# EAGLE design slave_05 (EAGLE 5.08)
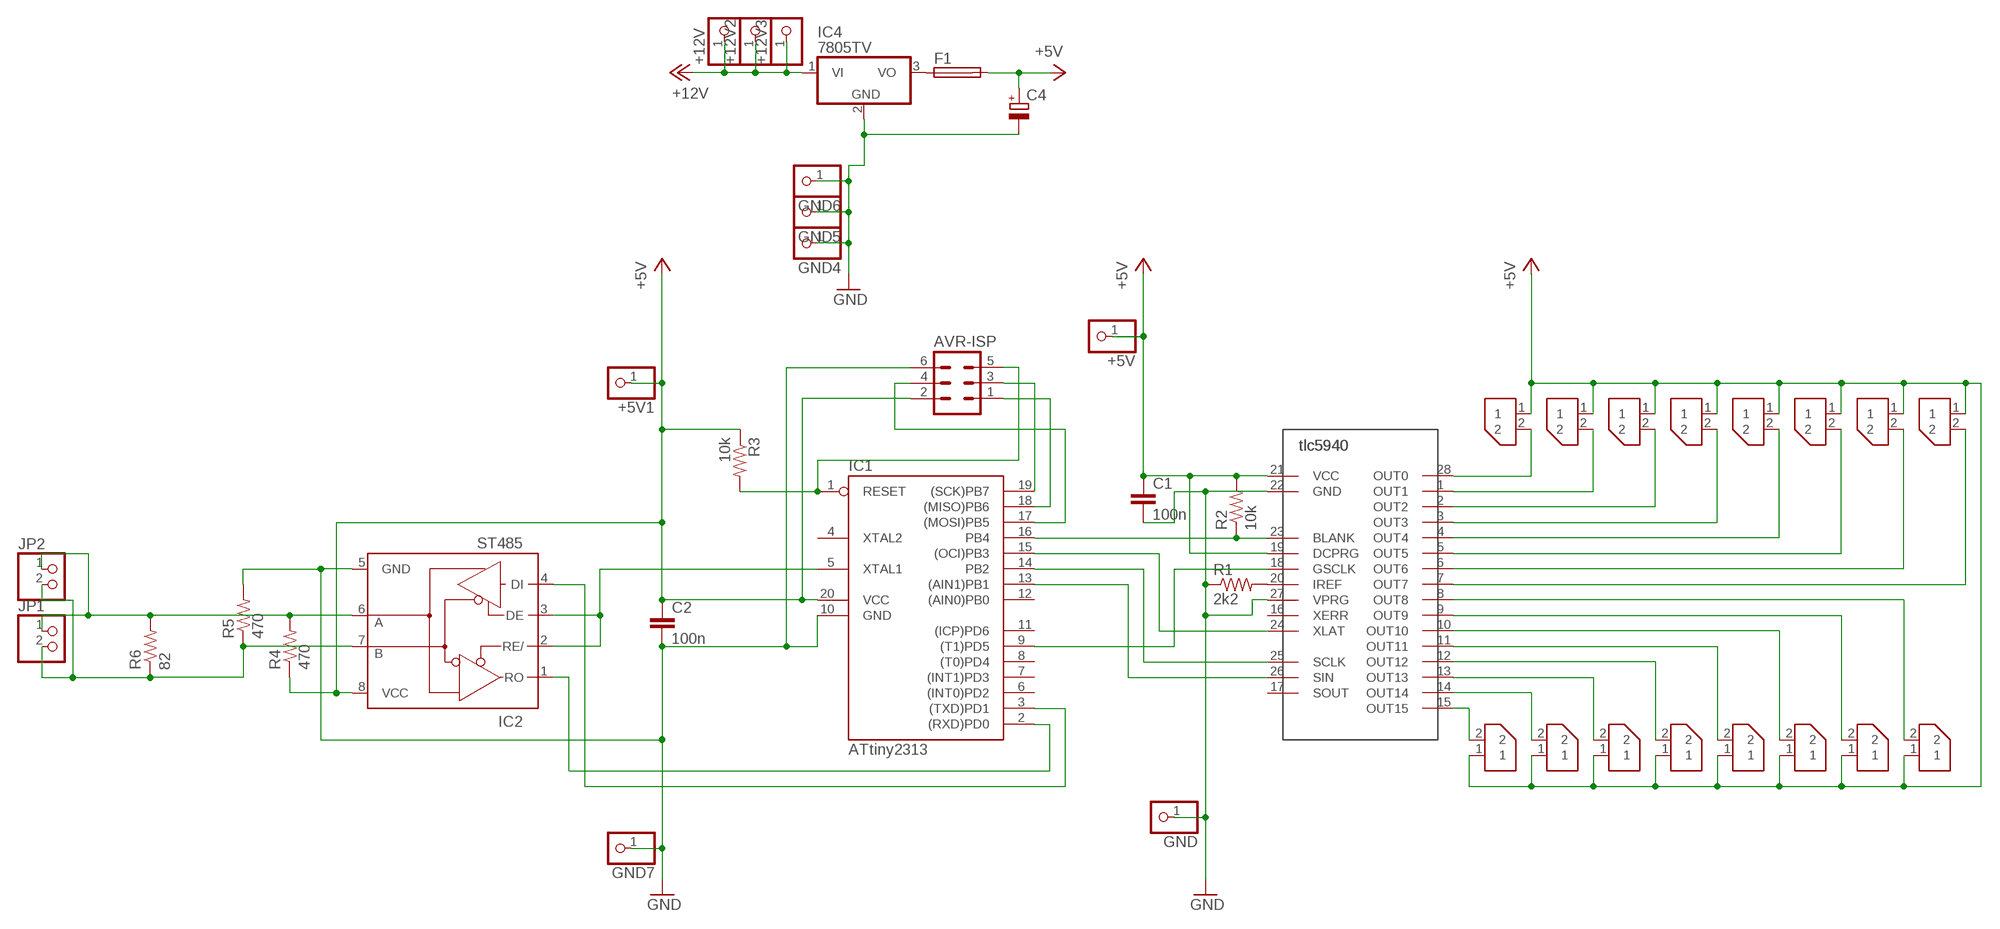
[diagram p0: schematic, sheet 1]

## Parts
+5V  PINHD-1X1  [1X01]
+5V1  PINHD-1X1  [1X01]
+12V  PINHD-1X1  [1X01]
+12V2  PINHD-1X1  [1X01]
+12V3  PINHD-1X1  [1X01]
AVR-ISP  ML6  [ML6]
C1  100n  C7.5/3  [C7.5B3]
C2  100n  C7.5/3  [C7.5B3]
C4  CPOL-EUE5-5  [E5-5]
F1  SH22,5A  [SH22,5A]
GND  PINHD-1X1  [1X01]
GND4  PINHD-1X1  [1X01]
GND5  PINHD-1X1  [1X01]
GND6  PINHD-1X1  [1X01]
GND7  PINHD-1X1  [1X01]
IC1  ATtiny2313  AT90S2313P  [DIL20]
IC2  ST485  MAX3468CPA  [DIL08]
IC4  7805TV  [TO220V]
JP1  PINHD-1X2  [1X02]
JP2  PINHD-1X2  [1X02]
R1  2k2  R-US_0204/7  [0204/7]
R2  10k  R-US_0207/10  [0207/10]
R3  10k  R-US_0204/7  [0204/7]
R4  470  R-US_0204/7  [0204/7]
R5  470  R-US_0204/7  [0204/7]
R6  82  R-US_0204/7  [0204/7]
U$1  TLC5940-NT  [28-DIL-300]
U$2  MOLEX-SPOX-HEADER-2-RA  [SPOX-WTB-HEADER-2-RA]
U$3  MOLEX-SPOX-HEADER-2-RA  [SPOX-WTB-HEADER-2-RA]
U$4  MOLEX-SPOX-HEADER-2-RA  [SPOX-WTB-HEADER-2-RA]
U$5  MOLEX-SPOX-HEADER-2-RA  [SPOX-WTB-HEADER-2-RA]
U$6  MOLEX-SPOX-HEADER-2-RA  [SPOX-WTB-HEADER-2-RA]
U$7  MOLEX-SPOX-HEADER-2-RA  [SPOX-WTB-HEADER-2-RA]
U$8  MOLEX-SPOX-HEADER-2-RA  [SPOX-WTB-HEADER-2-RA]
U$9  MOLEX-SPOX-HEADER-2-RA  [SPOX-WTB-HEADER-2-RA]
U$10  MOLEX-SPOX-HEADER-2-RA  [SPOX-WTB-HEADER-2-RA]
U$11  MOLEX-SPOX-HEADER-2-RA  [SPOX-WTB-HEADER-2-RA]
U$12  MOLEX-SPOX-HEADER-2-RA  [SPOX-WTB-HEADER-2-RA]
U$13  MOLEX-SPOX-HEADER-2-RA  [SPOX-WTB-HEADER-2-RA]
U$14  MOLEX-SPOX-HEADER-2-RA  [SPOX-WTB-HEADER-2-RA]
U$15  MOLEX-SPOX-HEADER-2-RA  [SPOX-WTB-HEADER-2-RA]
U$16  MOLEX-SPOX-HEADER-2-RA  [SPOX-WTB-HEADER-2-RA]
U$17  MOLEX-SPOX-HEADER-2-RA  [SPOX-WTB-HEADER-2-RA]

## Nets
+5V: +5V1.1 +5V.1 AVR-ISP.2 C1.1 C2.1 C4.+ F1.2 IC1.20(VCC) IC2.8(VCC) R2.2 R3.1 R4.1 U$1.19(DCPRG) U$1.21(VCC) U$2.1 U$3.1 U$4.1 U$5.1 U$6.1 U$7.1 U$8.1 U$9.1 U$10.1 U$11.1 U$12.1 U$13.1 U$14.1 U$15.1 U$16.1 U$17.1
+12V1: +12V2.1 +12V3.1 +12V.1 IC4.1(VI) ; supply symbol labelled +12V
GND: AVR-ISP.6 C1.2 C2.2 C4.- GND4.1 GND5.1 GND6.1 GND7.1 GND.1 IC1.10(GND) IC2.5(GND) IC4.2(GND) R1.1 R5.2 U$1.22(GND) U$1.27(VPRG)
N$1: IC1.15((OCI)PB3) U$1.24(XLAT)
N$2: IC1.16(PB4) R2.1 U$1.23(BLANK)
N$3: IC1.9((T1)PD5) U$1.18(GSCLK)
N$4: IC1.14(PB2) U$1.25(SCLK)
N$5: IC1.13((AIN1)PB1) U$1.26(SIN)
N$6: R1.2 U$1.20(IREF)
N$7: IC1.3((TXD)PD1) IC2.4(DI)
N$8: AVR-ISP.1 IC1.18((MISO)PB6)
N$10: IC1.2((RXD)PD0) IC2.1(RO)
N$11: AVR-ISP.3 IC1.19((SCK)PB7)
N$12: F1.1 IC4.3(VO)
N$13: U$1.28(OUT0) U$2.2
N$14: AVR-ISP.4 IC1.17((MOSI)PB5)
N$15: U$1.1(OUT1) U$3.2
N$16: U$1.2(OUT2) U$4.2
N$17: U$1.3(OUT3) U$5.2
N$18: U$1.15(OUT15) U$10.2
N$19: U$1.14(OUT14) U$11.2
N$20: U$1.13(OUT13) U$12.2
N$21: U$1.12(OUT12) U$13.2
N$22: U$1.11(OUT11) U$14.2
N$23: U$1.10(OUT10) U$15.2
N$24: U$1.9(OUT9) U$16.2
N$25: U$1.8(OUT8) U$17.2
N$26: U$1.4(OUT4) U$6.2
N$27: U$1.5(OUT5) U$7.2
N$28: U$1.6(OUT6) U$8.2
N$29: U$1.7(OUT7) U$9.2
N$31: AVR-ISP.5 IC1.1(RESET) R3.2
N$32: IC2.7(B) JP1.2 JP2.2 R5.1 R6.1
N$35: IC2.6(A) JP1.1 JP2.1 R4.2 R6.2
N$36: IC1.5(XTAL1) IC2.2(RE/) IC2.3(DE)
Unconnected: IC1.4(XTAL2) IC1.6((INT0)PD2) IC1.7((INT1)PD3) IC1.8((T0)PD4) IC1.11((ICP)PD6) IC1.12((AIN0)PB0) U$1.16(XERR) U$1.17(SOUT)

## Library data of the parts
+5V +5V1 +12V +12V2 +12V3 GND GND4-GND7 = pinhead:PINHD-1X1: PIN HEADER
AVR-ISP = con-harting-ml:ML6: HARTING
C1 C2 = capacitor-wima:C: CAPACITOR naming: grid - package width
C4 = resistor:CPOL-EU: POLARIZED CAPACITOR, European symbol
F1 = fuse:SH22,5A: FUSE HOLDER grid 22,5mm, isolated cap OGN0031 8201, Schurter (Buerklin)
IC1 = atmel:AT90S2313: MICROCONTROLLER 2 Kbytes FLASH 128 bytes SRAM 128 bytes EEPROM UART
IC2 = maxim:MAX34*: +5V, Fail-Safe, 40Mbps, Profibus RS-485/RS-422 Transceivers Source: MAX3465-MAX3469.pdf
IC4 = linear:78*: Positive VOLTAGE REGULATOR Source: http://cache.national.com/ds/LM/LM78L05.pdf http://www.fairchildsemi.com/ds/LM/LM7805.pdf
JP1 JP2 = pinhead:PINHD-1X2: PIN HEADER
R1-R6 = resistor:R-US_: RESISTOR, American symbol
U$1 = TLC5490:TLC5940-NT
U$2-U$17 = damians_bits:MOLEX-SPOX-HEADER-2-RA: Molex SPOX 22-05-7025 WTB Header, Right-angle, 2 way

## Board
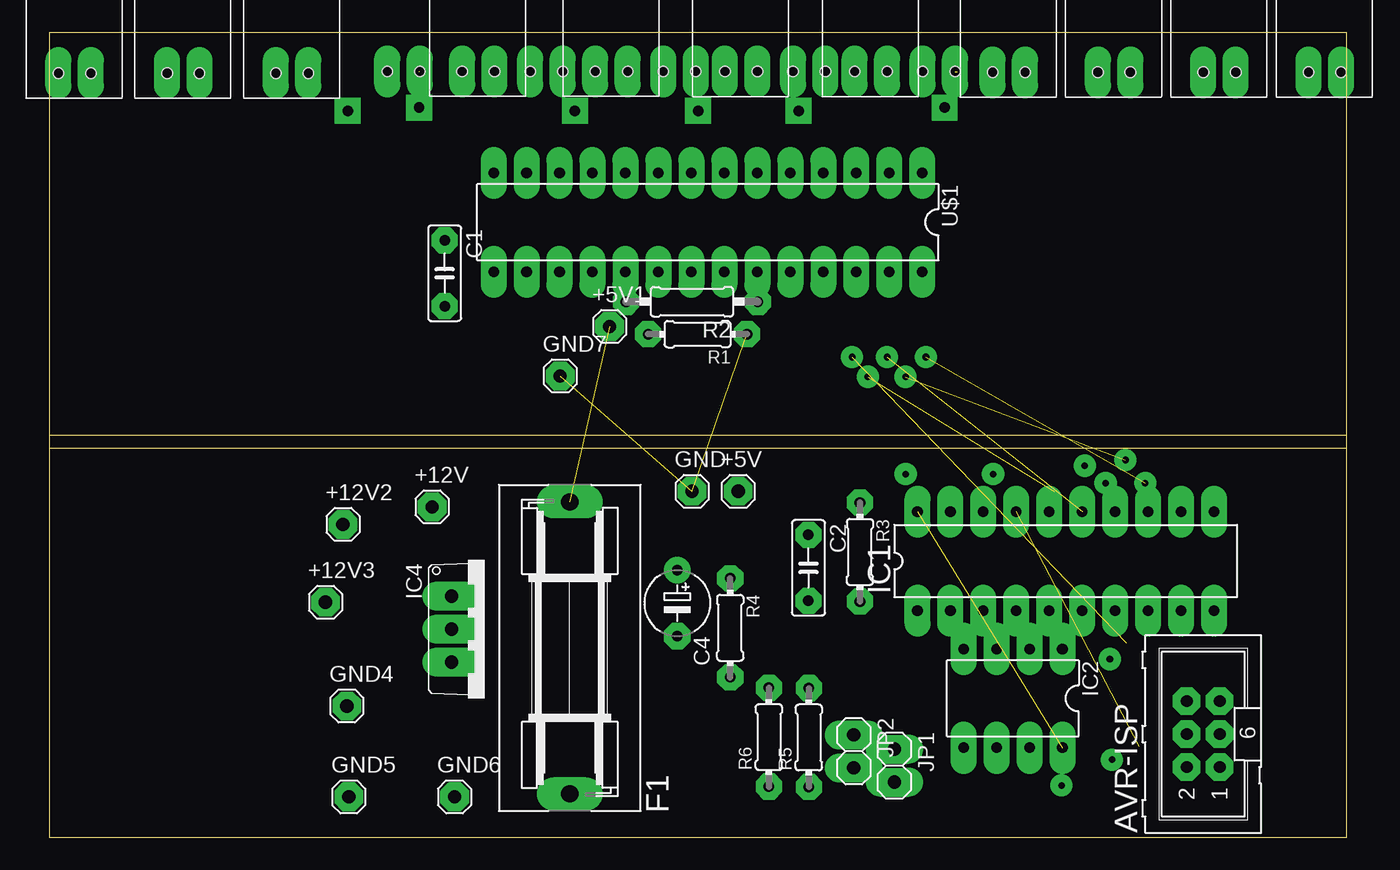
[diagram p1: board, top side]
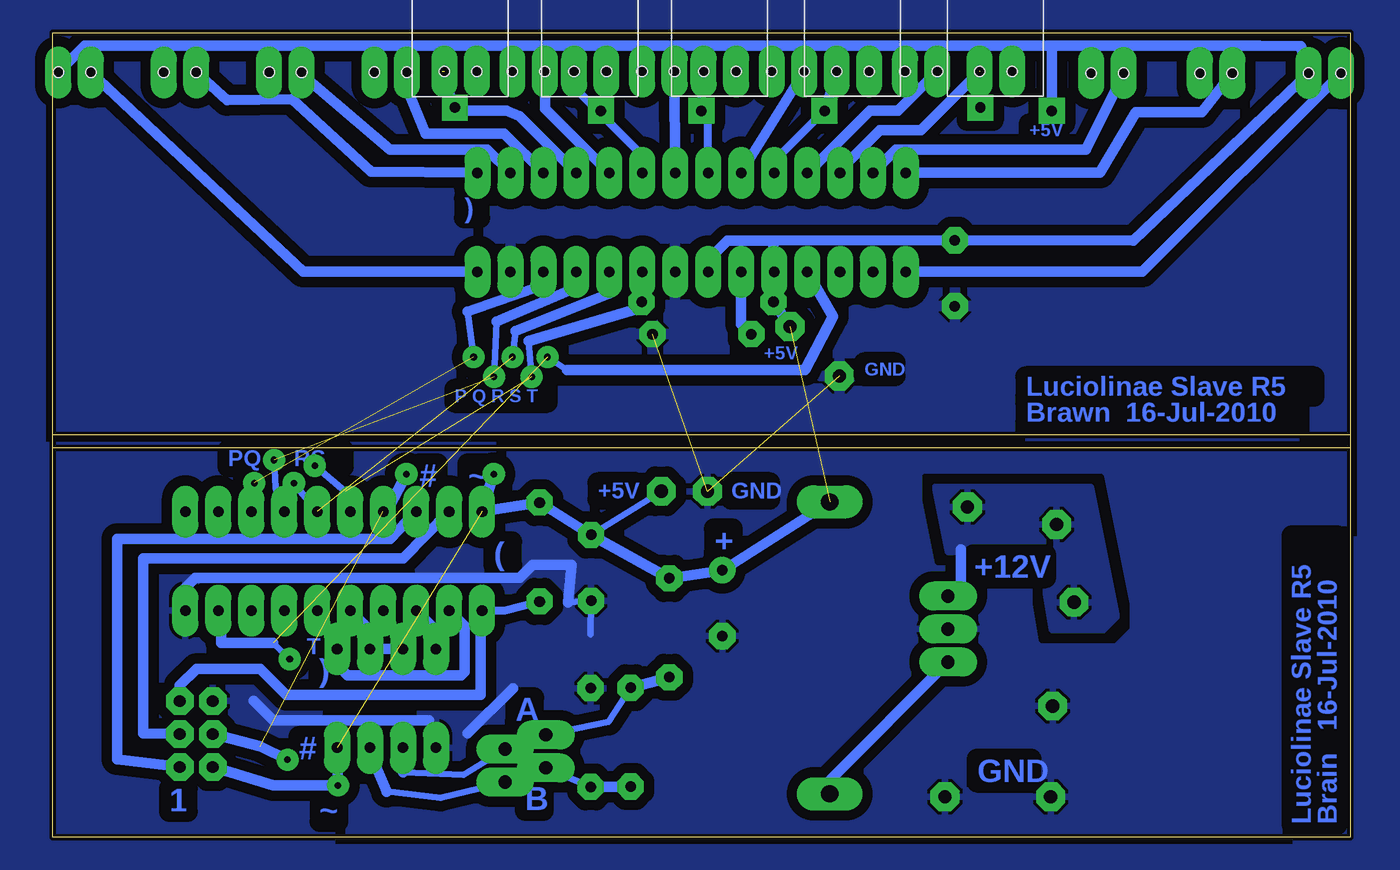
[diagram p2: board, bottom side, seen from below]

Size 100 x 62 mm. Coordinates in mm from the lower left corner, seen from the top.
Outline: 100,30 100,0 0,0 0,30
Outline: 100,30 100,31
Outline: 100,31 100,62 0,62 0,31
Outline: 0,31 0,30
Outline: 0,30 100,30
Outline: 0,31 100,31
Copper layers (1*16): Top 0.035mm / dielectric 1.5mm / Bottom 0.035mm
Design rules "default *": minimum track width 0.5mm, minimum drill 0.8mm, track to track 0.8mm, track to pad 0.8mm, pad to pad 0.45mm, via to via 0.8mm, smd to smd 8mil, copper to edge 10mil, drill to drill 8mil, minimum pad ring 0.6mm, minimum via ring 0.6mm, stop-mask expansion 0mil, vias tented up to drill 0mil, thermal gap 10mil

### Footprints (pad centres in the part's own frame; a part is rotated, then mirrored left to right if it is on the bottom)
1X01 = drill 1.016 octagon: 1 0,0
ML6 = drill 0.914 octagon: 1 -2.54,-1.27; 2 -2.54,1.27; 3 0,-1.27; 4 0,1.27; 5 2.54,-1.27; 6 2.54,1.27
C050-025X075 = drill 0.813 octagon: 1 -2.54,0; 2 2.54,0
E5-5 = drill 0.813 pad 1.905 round: + -2.54,0 | drill 0.813 pad 1.905 octagon: - 2.54,0
SH22,5A = drill 1.321 pad 2.54 long: 1 -11.252,0; 2 11.252,0
DIL20 = drill 0.813 long: 1 -11.43,-3.81; 2 -8.89,-3.81; 3 -6.35,-3.81; 4 -3.81,-3.81; 5 -1.27,-3.81; 6 1.27,-3.81; 7 3.81,-3.81; 8 6.35,-3.81; 9 8.89,-3.81; 10 11.43,-3.81; 11 11.43,3.81; 12 8.89,3.81; 13 6.35,3.81; 14 3.81,3.81; 15 1.27,3.81; 16 -1.27,3.81; 17 -3.81,3.81; 18 -6.35,3.81; 19 -8.89,3.81; 20 -11.43,3.81
DIL08 = drill 0.813 long: 1 -3.81,-3.81; 2 -1.27,-3.81; 3 1.27,-3.81; 4 3.81,-3.81; 5 3.81,3.81; 6 1.27,3.81; 7 -1.27,3.81; 8 -3.81,3.81
TO220V = drill 1.016 long: 1 -2.54,-2.54; 2 0,-2.54; 3 2.54,-2.54
1X02 = drill 1.016 long: 1 -1.27,0; 2 1.27,0
0204/7 = drill 0.813 octagon: 1 -3.81,0; 2 3.81,0
0207/10 = drill 0.813 octagon: 1 -5.08,0; 2 5.08,0
28-DIL-300 = drill 0.813 long: 1 -15.24,-3.81; 2 -12.7,-3.81; 3 -10.16,-3.81; 4 -7.62,-3.81; 5 -5.08,-3.81; 6 -2.54,-3.81; 7 0,-3.81; 8 2.54,-3.81; 9 5.08,-3.81; 10 7.62,-3.81; 11 10.16,-3.81; 12 12.7,-3.81; 13 15.24,-3.81; 14 17.78,-3.81; 15 17.78,3.81; 16 15.24,3.81; 17 12.7,3.81; 18 10.16,3.81; 19 7.62,3.81; 20 5.08,3.81; 21 2.54,3.81; 22 0,3.81; 23 -2.54,3.81; 24 -5.08,3.81; 25 -7.62,3.81; 26 -10.16,3.81; 27 -12.7,3.81; 28 -15.24,3.81
SPOX-WTB-HEADER-2-RA = drill 0.8 long: 1 1.19,0.56; 2 -1.31,0.56 | hole 0.8: -1.31,0.56; 1.19,0.56

### Placement (x,y rotation side)
+5V  53.09,26.67 0 top
+5V1  43.18,39.37 0 top
+12V  29.49,25.47 0 top
+12V2  22.63,24.12 0 top
+12V3  21.28,18.12 0 top
AVR-ISP  88.92,7.96 90 top
C1  100n  [C050-025X075]  30.47,43.48 270 top
C2  100n  [C050-025X075]  58.5,20.77 270 top
C4  48.39,18.05 270 top
F1  40.11,14.6 90 top
GND  49.53,26.67 0 top
GND4  22.93,10.12 0 top
GND5  23.08,3.12 0 top
GND6  31.23,3.12 0 top
GND7  39.37,35.56 0 top
IC1  78.33,21.29 0 top
IC2  74.26,10.71 180 top
IC4  33.53,16.05 270 top
JP1  65.12,5.53 270 top
JP2  61.99,6.62 270 top
R1  49.95,38.78 180 top
R2  49.52,41.28 180 top
R3  62.47,21.99 270 top
R4  52.47,16.15 270 top
R5  58.53,7.69 90 top
R6  55.45,7.72 90 top
U$1  52.02,47.41 180 top
U$2  98.36,58.41 0 top
U$3  90.24,58.41 0 top
U$4  82.12,58.41 0 top
U$5  74,58.41 0 top
U$6  68.49,58.47 0 bottom
U$7  63.37,58.47 0 top
U$8  58.5,58.47 0 bottom
U$9  53.38,58.47 0 top
U$10  2.01,58.34 0 top
U$11  10.39,58.34 0 top
U$12  18.77,58.34 0 top
U$13  27.24,58.48 0 bottom
U$14  33.12,58.48 0 top
U$15  38.25,58.48 0 bottom
U$16  43.38,58.48 0 top
U$17  48.51,58.48 0 bottom

### Tracks (layer width: path | path; a pad name or v marks a point on that pad's centre or on a via)
+5V  (via drill 0.8)  (2 unrouted)
  Bottom 0.406: U$13.1 26.05,60.95 26,61 | U$15.1 37.06,60.94 37,61 | U$17.1 47.32,60.68 47,61 | U$8.1 57.31,60.69 57,61 | U$6.1 67.3,60.7 67,61
  Bottom 0.508: C2.1 +5V.1
  Bottom 0.813: F1.2 C4.+ R4.1 C2.1 R3.1 IC1.20 66,28 | IC2.8 78,4 83,4 AVR-ISP.2 | U$1.21 49,44.08 49,45 48,46 44.45,46 | 12,61 7,61 3.81,60.96 U$10.1 16.73,46 C1.1 44.45,46 | 12,61 20,61 | 20,61 23,61 | 23,61 26,61 34,61 | 34,61 37,61 44,61 | 44,61 47,61 55,61 | 55,61 57,61 65,61 | 65,61 67,61 75,61 | 75,61 83,61 | 83,61 92,61 | 92,61 97.52,61 U$2.1 | U$11.1 11.58,60.58 12,61 | U$12.1 19.96,60.96 20,61 | U$14.1 34.31,60.69 34,61 | U$3.1 91.43,60.43 92,61 | U$4.1 83.31,60.69 83,61 | U$5.1 75.19,60.81 75,61 | U$7.1 64.56,60.56 65,61 | U$16.1 44.57,60.43 44,61 | U$9.1 54.57,60.57 55,61 | 44.45,43.55 R2.2 +5V1.1 | 44.45,43.55 U$1.19 | 23,61 v23,56 | 44.45,46 44.45,43.55
+12V1
  Bottom 0.8: 30,22.19 30,19 IC4.1
  pour Bottom: 19,16 23,16 24,22 31,22 32,27 20,27 18,17
GND  (2 unrouted)
  Bottom 0.508: 58.53,15.66 C2.2 60.28,18.09
  Bottom 0.8: 30,16 IC4.2
  Bottom 0.813: 84.5,10.5 83,9 71,9 | IC2.5 70,7.35 | 68,8 64.5,11.5 | 89.76,19.24 89,20 64,20 63,21 60,21 60.28,18.09
  pour Bottom (rank 2): 0,30 100,30 100,0 0,0
  pour Bottom: 0,31 100,31 100,62 0,62
N$1  (via drill 0.51)  (1 unrouted)
  Bottom 0.508: 64.3,39.01 v64.56,37.02 | IC1.15 v81.41,27.3
  Bottom 0.813: U$1.24 57.1,41.9 64.3,39.01
N$2  (via drill 0.51, 0.51 pad 1.68)  (1 unrouted)
  Bottom 0.508: 63.33,38.25 v63.08,35.49 | IC1.16 77.47,26.67 v79.79,28.64
  Bottom 0.813: U$1.23 54.56,41.33 R2.1 54.72,40.78 63.33,38.25
N$3  (via drill 0.51)  (1 unrouted)
  Bottom 0.508: 60.33,36 v61.86,37.02 | v81.73,13.73 83,15
  Bottom 0.813: IC1.9 87,17.26 87,15 83,15 | U$1.18 39.86,40.14 42,36 60.33,36
N$4  (via drill 0.51)  (1 unrouted)
  Bottom 0.508: v65.98,35.49 65.78,39.77 | IC1.14 82.8,26.92 v82.93,29.08
  Bottom 0.813: U$1.25 59.64,42.37 65.78,39.77
N$5  (via drill 0.51)  (1 unrouted)
  Bottom 0.508: v67.56,37.02 68.02,40.54 | IC1.13 v84.45,27.3
  Bottom 0.813: U$1.26 62.18,42.58 68.02,40.54
N$6
  Bottom 0.813: U$1.20 46.94,39.58 R1.2
N$7
  Bottom 0.813: IC1.3 70.45,15.95 IC2.4
N$8
  Bottom 0.813: IC1.18 74,23 95,23 95,6 AVR-ISP.1
N$9  (via drill 0.51)
  other vias: 78,4
N$10
  Bottom 0.813: IC1.2 68.25,16.29 68.25,12.75 68.5,12.5 77.25,12.5 78.07,13.32 IC2.1
N$11
  Bottom 0.813: IC1.19 73,21.5 93,21.5 93,8 AVR-ISP.3
N$12
  Bottom 0.813: IC4.3 40.11,4.39 F1.1
N$13
  Bottom 0.813: U$1.28 80.68,43.6 U$2.2
N$14  (via drill 0.51)  (1 unrouted)
  Bottom 0.813: AVR-ISP.4 84,7 v81.89,5.98 | IC1.17 74,25.62 72.73,28
N$15
  Bottom 0.813: U$1.1 75.44,51.31 81.53,56.9 86.53,56.81 U$3.2
N$16
  Bottom 0.813: U$4.2 80.81,58.81 74,53 66.5,53 U$1.2
N$17
  Bottom 0.813: U$5.2 72.69,57.69 71.25,54.25 65.21,54.25 U$1.3
N$18
  Bottom 0.813: U$1.15 16,43.6 U$10.2
N$19
  Bottom 0.813: U$1.14 19.3,51.22 16.51,55.88 11.43,55.88 U$11.2
N$20
  Bottom 0.813: U$1.13 35,53 20.36,53 U$12.2
N$21  (via drill 0.8)  (1 unrouted)
  Bottom 0.813: U$1.12 39.32,51.43 36.25,54.5 33.09,54.5 U$13.2 | v28.5,56.25 28.5,59
N$22
  Bottom 0.813: U$1.11 41.78,51.22 37,56 34.85,56 U$14.2
N$23  (via drill 0.8)
  Bottom 0.61: 44.4,51.85 44.4,52.1 v40.5,56
  Bottom 0.813: U$1.10 44.4,51.85 | v40.5,56 39.5,58.98 U$15.2
N$24
  Bottom 0.813: U$1.9 U$16.2
N$25  (via drill 0.8)
  Bottom 0.61: U$1.8 49.48,55.48 v50,56 50,58.86
  Bottom 0.813: 50,58.86 U$17.2
N$26  (via drill 0.8)  (1 unrouted)
  Bottom 0.813: U$6.2 69.8,57.8 69,56 65,56 64,55.58 U$1.4 | v69,56.25 70,59
N$27
  Bottom 0.813: U$7.2 62.06,56.18 U$1.5
N$28  (via drill 0.8)
  Bottom 0.61: U$1.6 55,51.66 55,53 57.75,55.75 v57.75,56 58,56 60,58 60,58.84 U$8.2
N$29
  Bottom 0.813: U$1.7 U$9.2
N$30  (via drill 0.51)
  other vias: 66,28
N$31
  Bottom 0.61: R3.2 65.17,17.48 IC1.1
  Bottom 0.813: IC1.1 67,15.38 67,11 82,11 84,13 88.91,13 90.19,11.71 AVR-ISP.5
N$32
  Bottom 0.508: R5.1 JP2.2 JP1.2 70.1,3.05 74.27,3.55
  Bottom 0.813: R6.1 R5.1 | IC2.7 75.53,6.53 74.27,3.55 74.25,3.5
N$33  (via drill 0.51)
  other vias: 72.73,28
N$35
  Bottom 0.508: R6.2 57.15,8.89 JP2.1 JP1.1 68.33,4.83 72.99,5.01
  Bottom 0.813: R4.2 R6.2 | IC2.6 72.99,5.01 73,5
N$36
  Bottom 0.813: IC1.5 75.53,15.95 IC2.2 IC2.3
N$45
  pour Bottom (rank 3): -17,77 -17,-12 121,-12 121,77

### Text on the board
Bottom: +5V | ) | +5V | GND | Luciolinae Slave R5 | P Q R S T | Brawn 16-Jul-2010 | PQ RS | ~ | # | GND | +5V | + | ( | +12V | T | ) | A | # | GND | ~ | B | 1 | Brain 16-Jul-2010 | Luciolinae Slave R5